# EAGLE schematic pwm-control (EAGLE 6.5.0)
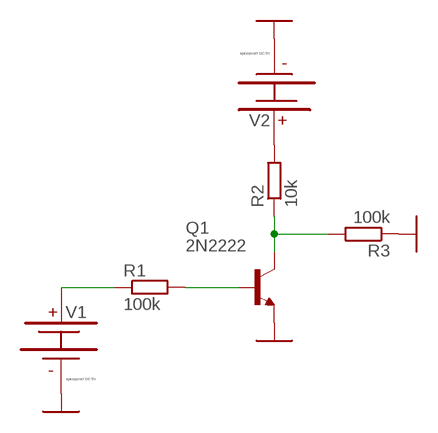
[diagram p0: schematic, sheet 1]

## Parts
Q1  2N2222  [TO92-EBC-OVAL]
R1  100k  R-EU_0204/2V  [0204V]
R2  10k  R-EU_0204/2V  [0204V]
R3  100k  R-EU_0204/2V  [0204V]
V1  VSOURCE  [VSOURCE]
V2  VSOURCE  [VSOURCE]

## Nets
GND: Q1.E R3.1 V1.2 V2.2
N$1: R2.2 V2.1
N$2: Q1.B R1.2
VIN: R1.1 V1.1
VOUT: Q1.C R2.1 R3.2

## Library data of the parts
Q1 = adafruit:2N2222: NPN TRANSISTOR Big oval pads
R1-R3 = rcl:R-EU_: RESISTOR, European symbol
V1 V2 = SPICE:VSOURCE